# EAGLE design electrophy_NRF (EAGLE 7.2.0)
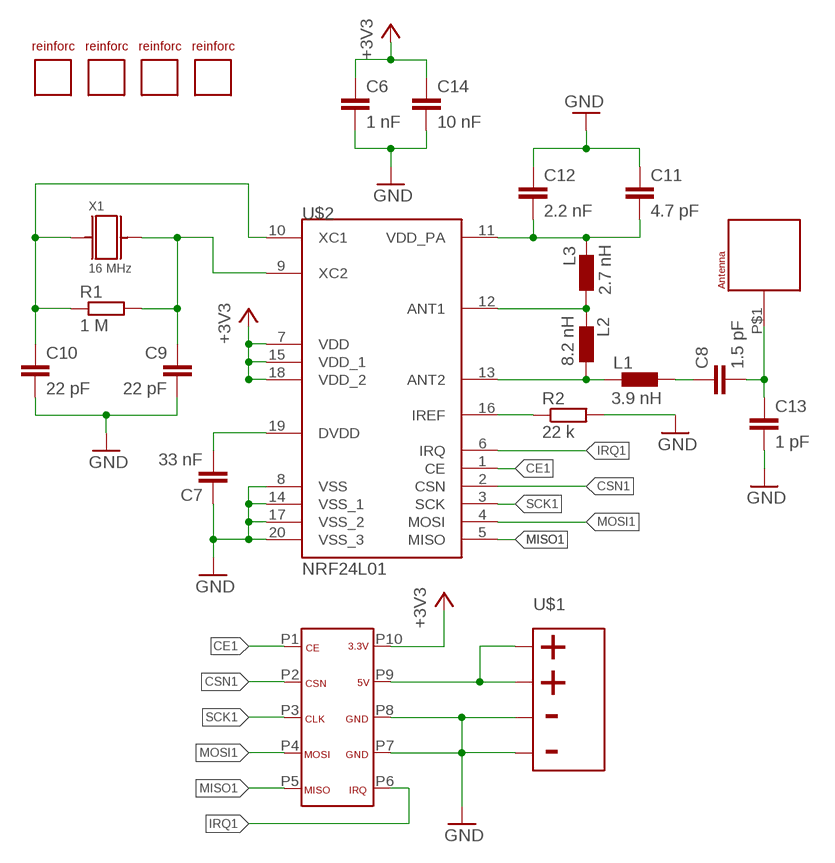
[diagram p0: schematic, sheet 1]

## Parts
C6  1 nF  C-EUC0603  [C0603]
C7  33 nF  C-EUC0603  [C0603]
C8  1.5 pF  C-EUC0603  [C0603]
C9  22 pF  C-EUC0603  [C0603]
C10  22 pF  C-EUC0603  [C0603]
C11  4.7 pF  C-EUC0603  [C0603]
C12  2.2 nF  C-EUC0603  [C0603]
C13  1 pF  C-EUC0603  [C0603]
C14  10 nF  C-EUC0603  [C0603]
L1  3.9 nH  INDUCTANCE  [C0603]
L2  8.2 nH  INDUCTANCE  [C0603]
L3  2.7 nH  INDUCTANCE  [C0603]
R1  1 M  R-EU_R0603  [R0603]
R2  22 k  R-EU_R0603  [R0603]
U$1  BAT_HOLDER  [BAT_HOLDER]
U$2  NRF24L01  [QFN20]
U$3  WURTH_ANTENNA  [WURTH_ANTENNA]
U$4  DF12-10-MALE  [DF12-10-MALE]
U$5  REINFORCEMENT  [REINFORCEMENT]
U$6  REINFORCEMENT  [REINFORCEMENT]
U$7  REINFORCEMENT  [REINFORCEMENT]
U$8  REINFORCEMENT  [REINFORCEMENT]
X1  16 MHz  NRF_XTAL  [NRF_XTAL]

## Nets
+3V3: C6.1 C14.1 U$2.7(VDD) U$2.15(VDD_1) U$2.18(VDD_2) U$4.P10
CE1: U$2.1(CE) U$4.P1
CSN1: U$2.2(CSN) U$4.P2
GND: C6.2 C7.1 C9.2 C10.2 C11.1 C12.1 C13.2 C14.2 R2.2 U$1.PMOINS U$1.PMOINSBIS U$2.8(VSS) U$2.14(VSS_1) U$2.17(VSS_2) U$2.20(VSS_3) U$4.P7 U$4.P8
IRQ1: U$2.6(IRQ) U$4.P6
MISO1: U$2.5(MISO) U$4.P5
MOSI1: U$2.4(MOSI) U$4.P4
N$2: C7.2 U$2.19(DVDD)
N$3: C11.2 C12.2 L3.2 U$2.11(VDD_PA)
N$4: R2.1 U$2.16(IREF)
N$5: L1.2 L2.1 U$2.13(ANT2)
N$7: C9.1 R1.2 U$2.9(XC2) X1.P$1
N$8: L2.2 L3.1 U$2.12(ANT1)
N$9: C8.2 C13.1 U$3.P$1
N$10: C8.1 L1.1
N$17: C10.1 R1.1 U$2.10(XC1) X1.P$2
PPLUS: U$1.PPLUS U$1.PPLUSBIS U$4.P9
SCK1: U$2.3(SCK) U$4.P3
Unconnected: U$5.P$1 U$6.P$1 U$7.P$1 U$8.P$1

## Library data of the parts
C6-C14 = resistor:C-EU: CAPACITOR, European symbol
L1-L3 = inductance:INDUCTANCE
R1 R2 = resistor:R-EU_: RESISTOR, European symbol
U$1 = bat_holder:BAT_HOLDER
U$2 = nrf24l01:NRF24L01: nRF24L01 Single chip 2.4GHz transceiver from Nordic Semiconductors.
U$3 = wurth_antenna:WURTH_ANTENNA
U$4 = Hirose_DF12:DF12-10-MALE
U$5-U$8 = reinforcement:REINFORCEMENT
X1 = NRF_Xtal:NRF_XTAL

## Net classes
0 default: clearance 0.205 mm

## Board
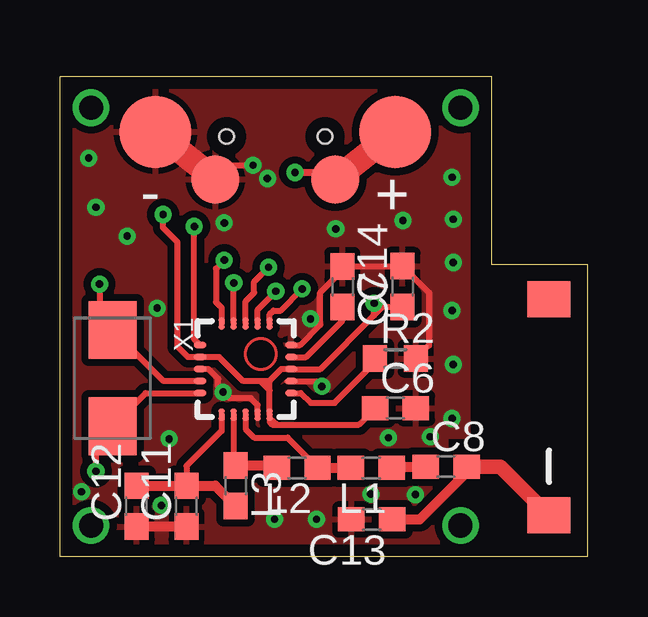
[diagram p1: board, top side]
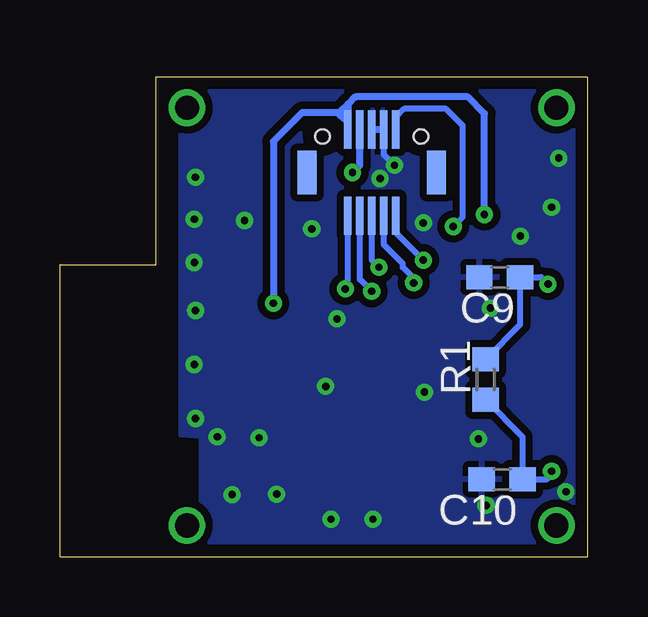
[diagram p2: board, bottom side, seen from below]

Size 22 x 20 mm. Coordinates in mm from the lower left corner, seen from the top.
Outline: 22,0 22,12.15 18,12.15 18,20 0,20 0,0 22,0
Copper layers (1*16): Top 0.035mm / dielectric 1.5mm / Bottom 0.035mm
Design rules "default *": minimum track width 8mil, minimum drill 12mil, track to track 8mil, track to pad 8mil, pad to pad 8mil, via to via 8mil, smd to smd 8mil, copper to edge 20mil, drill to drill 8mil, minimum pad ring 10mil, minimum via ring 8mil, stop-mask expansion 4mil, vias tented up to drill 12mil, thermal gap 10mil

### Footprints (pad centres in the part's own frame; a part is rotated, then mirrored left to right if it is on the bottom)
C0603 = smd 1.1 x 1: 1 -0.85,0; 2 0.85,0
R0603 = smd 1 x 1.1: 1 -0.85,0; 2 0.85,0
BAT_HOLDER = smd 3 x 3: PMOINS -5.02,0.04; PPLUS 4.98,0.04 | smd 2 x 2: PMOINSBIS -2.52,-1.94; PPLUSBIS 2.48,-1.94
QFN20 = smd 0.5 x 0.25: 1 -1.9,1; 2 -1.9,0.5; 3 -1.9,0; 4 -1.9,-0.5; 5 -1.9,-1; 11 1.9,-1; 12 1.9,-0.5; 13 1.9,0; 14 1.9,0.5; 15 1.9,1 | smd 0.25 x 0.5: 6 -1,-1.9; 7 -0.5,-1.9; 8 0,-1.9; 9 0.5,-1.9; 10 1,-1.9; 16 1,1.9; 17 0.5,1.9; 18 0,1.9; 19 -0.5,1.9; 20 -1,1.9
WURTH_ANTENNA = smd 1.5 x 1.8: P$1 0,0; P$2 9,0
DF12-10-MALE = smd 0.8 x 1.8: HOLD1 2.7,0; HOLD2 -2.7,0 | smd 0.3 x 1.6: P1 -1,-1.8; P2 -0.5,-1.8; P3 0,-1.8; P4 0.5,-1.8; P5 1,-1.8; P6 1,1.8; P7 0.5,1.8; P8 0,1.8; P9 -0.5,1.8; P10 -1,1.8 | hole 0.6: -2.05,1.5; 2.05,1.5
REINFORCEMENT = drill 1.016: P$1 0,0
NRF_XTAL = smd 2.4 x 2: P$1 -2.005,0; P$2 2,0

### Placement (x,y rotation side)
C6  13.99,6.18 0 top
C7  11.78,11.24 270 top
C8  16.1,3.74 0 top
C9  3.66,11.64 180 bottom
C10  3.56,3.22 180 bottom
C11  5.28,2.1 90 top
C12  3.2,2.1 90 top
C13  13,1.55 180 top
C14  14.29,11.25 90 top
L1  12.98,3.7 180 top
L2  9.89,3.7 180 top
L3  7.32,2.95 270 top
R1  4.25,7.38 90 bottom
R2  13.99,8.25 0 top
U$1  9,17.65 0 top
U$2  7.74,7.81 270 top
U$3  20.39,1.71 90 top
U$4  9,16 0 bottom
U$5  1.3,1.3 0 top
U$6  16.7,1.3 0 top
U$7  1.3,18.7 0 top
U$8  16.7,18.7 0 top
X1  2.19,7.43 270 top

### Tracks (layer width: path | path; a pad name or v marks a point on that pad's centre or on a via)
+3V3  (via drill 0.3 pad 0.25)
  Top 0.254: 8.72,7.31 9.22,7.81 U$2.18 10.86,7.81 13.1,10.05 | 8.72,7.31 7.64,7.31 6.64,8.31 U$2.7 5.34,8.31 4.9,8.75 4.9,13.1 4.3,13.7 v4.3,14.25 | 8.72,7.31 arc-90 8.74,7.29 8.74,6.92 | 8.74,7.31 8.72,7.31 | 13.16,10.55 13.31,10.4 13.45,10.4 | 13.45,10.4 C14.1 | 9.05,5.5 8.85,5.5 8.74,5.61 U$2.15 8.74,6.92 | 9.05,5.5 12.46,5.5 C6.1 12.89,6.18 | 13.1,10.05 v13.1,10.55 | 13.1,10.05 13.45,10.4 | 8.74,6.92 8.4,7.26 8.4,7.3 | 9.05,5.5 8.75,5.75
  Top 0.3: 13.16,10.55 v13.1,10.55
  Bottom 0.203: 10,18.5 U$4.P10
  Bottom 0.3: 9.7,19.15 10,18.85 | 10,18.85 10,18.5 10.45,18.5 | 10.45,18.5 11.9,18.5 13.1,17.3 v13.1,10.55 | v4.3,14.25 4.3,18.45 5,19.15 9.65,19.15 | 10,18.85 10.3,18.55 | 10.45,18.5 10.05,18.15
CE1  (via drill 0.3 pad 0.25)
  Top 0.254: U$2.1 8.74,10.09 8.9,10.25 9.2,10.25 v10.1,11.15
  Bottom 0.254: v10.1,11.15 10,11.25 U$4.P1
CSN1  (via drill 0.3 pad 0.25)
  Top 0.254: U$2.2 8.24,10.29 v9,11.05
  Bottom 0.254: v9,11.05 9.5,11.55 U$4.P2
GND  (via drill 0.3 pad 0.25)
  Top 0.203: 9.46,7.29 U$2.17 | U$1.PMOINSBIS 6.72,15.95
  Top 0.254: U$2.17 10.89,7.31 11.04,7.16 | U$2.20 10.01,8.81 10.85,9.65 10.85,11 11.78,11.93 C7.1 | U$2.14 8.24,6.31 7.95,6.6 7.05,6.6 v6.8,6.85 6.6,7.05 6.6,7.4 6.19,7.81 U$2.8 | C11.1 5.48,1.05 | 11.88,12.03 C7.1 | C7.1 11.89,12.1 C14.2 15.39,11 15.39,8.8 R2.2 | 6.72,15.95 7.07,16.3 v8.05,16.3
  Top 0.406: C11.1 C12.1
  Top 1.016: U$1.PMOINSBIS U$1.PMOINS
  Bottom 0.254: v8.05,16.3 8.5,16.75 U$4.P7
  Bottom 0.3: U$4.P8 U$4.P7
  other vias: 10.92,7.09 2.8,13.35 11.5,13.65 16.4,14.05 4.55,4.9 0.9,2.7 6.85,13.9 14.3,14 1.2,16.6 10.45,9.9 8.95,1.55 4.23,2.13 13.7,4.95 16.35,5.75 10.7,1.55 4.05,10.35 16.4,12.25 16.35,10.25 16.4,8 16.35,15.8 1.5,14.55 8.65,15.75 14.82,2.58 12.96,2.6 15.44,4.99
  pour Top (isolate 0.305): 0.1,19.9 17,19.9 17,5 16.1,5 16.1,0.1 0.1,0.1
  pour Bottom (isolate 0.305): 0.1,0.1 16.1,0.1 16.1,5 16.95,5.05 16.95,19.95 0.1,19.9
IRQ1  (via drill 0.3 pad 0.25)
  Top 0.254: U$2.6 5.6,9.05 v5.6,13.75
  Bottom 0.203: 8,18.3 U$4.P6
  Bottom 0.254: v5.6,13.75 5.2,14.15 5.2,17.95 5.9,18.65 7.65,18.65 8,18.3
MISO1  (via drill 0.3 pad 0.25)
  Top 0.254: v6.85,12.35 6.5,12 6.5,10.6 6.74,10.36 U$2.5
  Bottom 0.254: v6.85,12.35 8,13.5 U$4.P5
MOSI1  (via drill 0.3 pad 0.25)
  Top 0.203: v7.24,11.39 v7.25,11.4
  Top 0.254: U$2.4 v7.24,11.39
  Bottom 0.203: v7.25,11.4 7.25,11.6
  Bottom 0.254: 7.25,11.6 7.7,12.05 7.7,12.2 8.5,13 U$4.P4
N$2
  Top 0.254: U$2.19 10.26,8.31 11.78,9.83 C7.2
N$3
  Top 0.254: U$2.11 6.74,5.24 5.28,3.78 C11.2
  Top 0.406: C12.2 C11.2 6.47,2.95 L3.2
N$4
  Top 0.254: 13.3,8.25 R2.1 13.14,8.09 11.45,6.4 10.45,6.4 10.04,6.81 U$2.16
N$5
  Top 0.254: U$2.13 7.74,5.31 8.1,4.95 9.49,4.95 L2.1
  Top 0.406: L2.1 L1.2
N$7  (via drill 0.3 pad 0.25)
  Top 0.203: 1.65,9.97 X1.P$1
  Top 0.254: U$2.9 4.32,7.31 X1.P$1 | v1.65,11.35 1.65,9.97
  Bottom 0.254: v1.65,11.35 1.94,11.64 C9.1 2.81,9.67 R1.2
N$8
  Top 0.254: U$2.12 7.24,3.88 L3.1 | 8.94,3.8 L2.2
  Top 0.406: L3.1 8.94,3.8
N$9
  Top 0.406: 16.95,3.6 C8.2 16.95,3.5 15,1.55 C13.1
  Top 0.6: U$3.P$1 18.36,3.74 C8.2
N$10
  Top 0.406: L1.1 13.87,3.74 C8.1
N$17  (via drill 0.3 pad 0.25)
  Top 0.203: 1.5,4.74 X1.P$2
  Top 0.254: v1.5,3.55 1.5,4.74 | X1.P$2 3.57,6.81 U$2.10
  Bottom 0.254: v1.5,3.55 1.68,3.22 C10.1 2.71,4.99 R1.1
PPLUS  (via drill 0.3 pad 0.25)
  Top 0.203: U$1.PPLUSBIS 11.19,16
  Top 0.3: 11.19,16 v9.8,16
  Top 1.016: U$1.PPLUS U$1.PPLUSBIS
  Bottom 0.3: v9.8,16 9.5,16.3 U$4.P9
SCK1  (via drill 0.3 pad 0.25)
  Top 0.254: U$2.3 7.74,10.64 8.1,11 8.1,11.45 v8.7,12.05
  Bottom 0.254: v8.7,12.05 9,12.35 U$4.P3